# EAGLE design BMWifi (EAGLE 9.6.1)
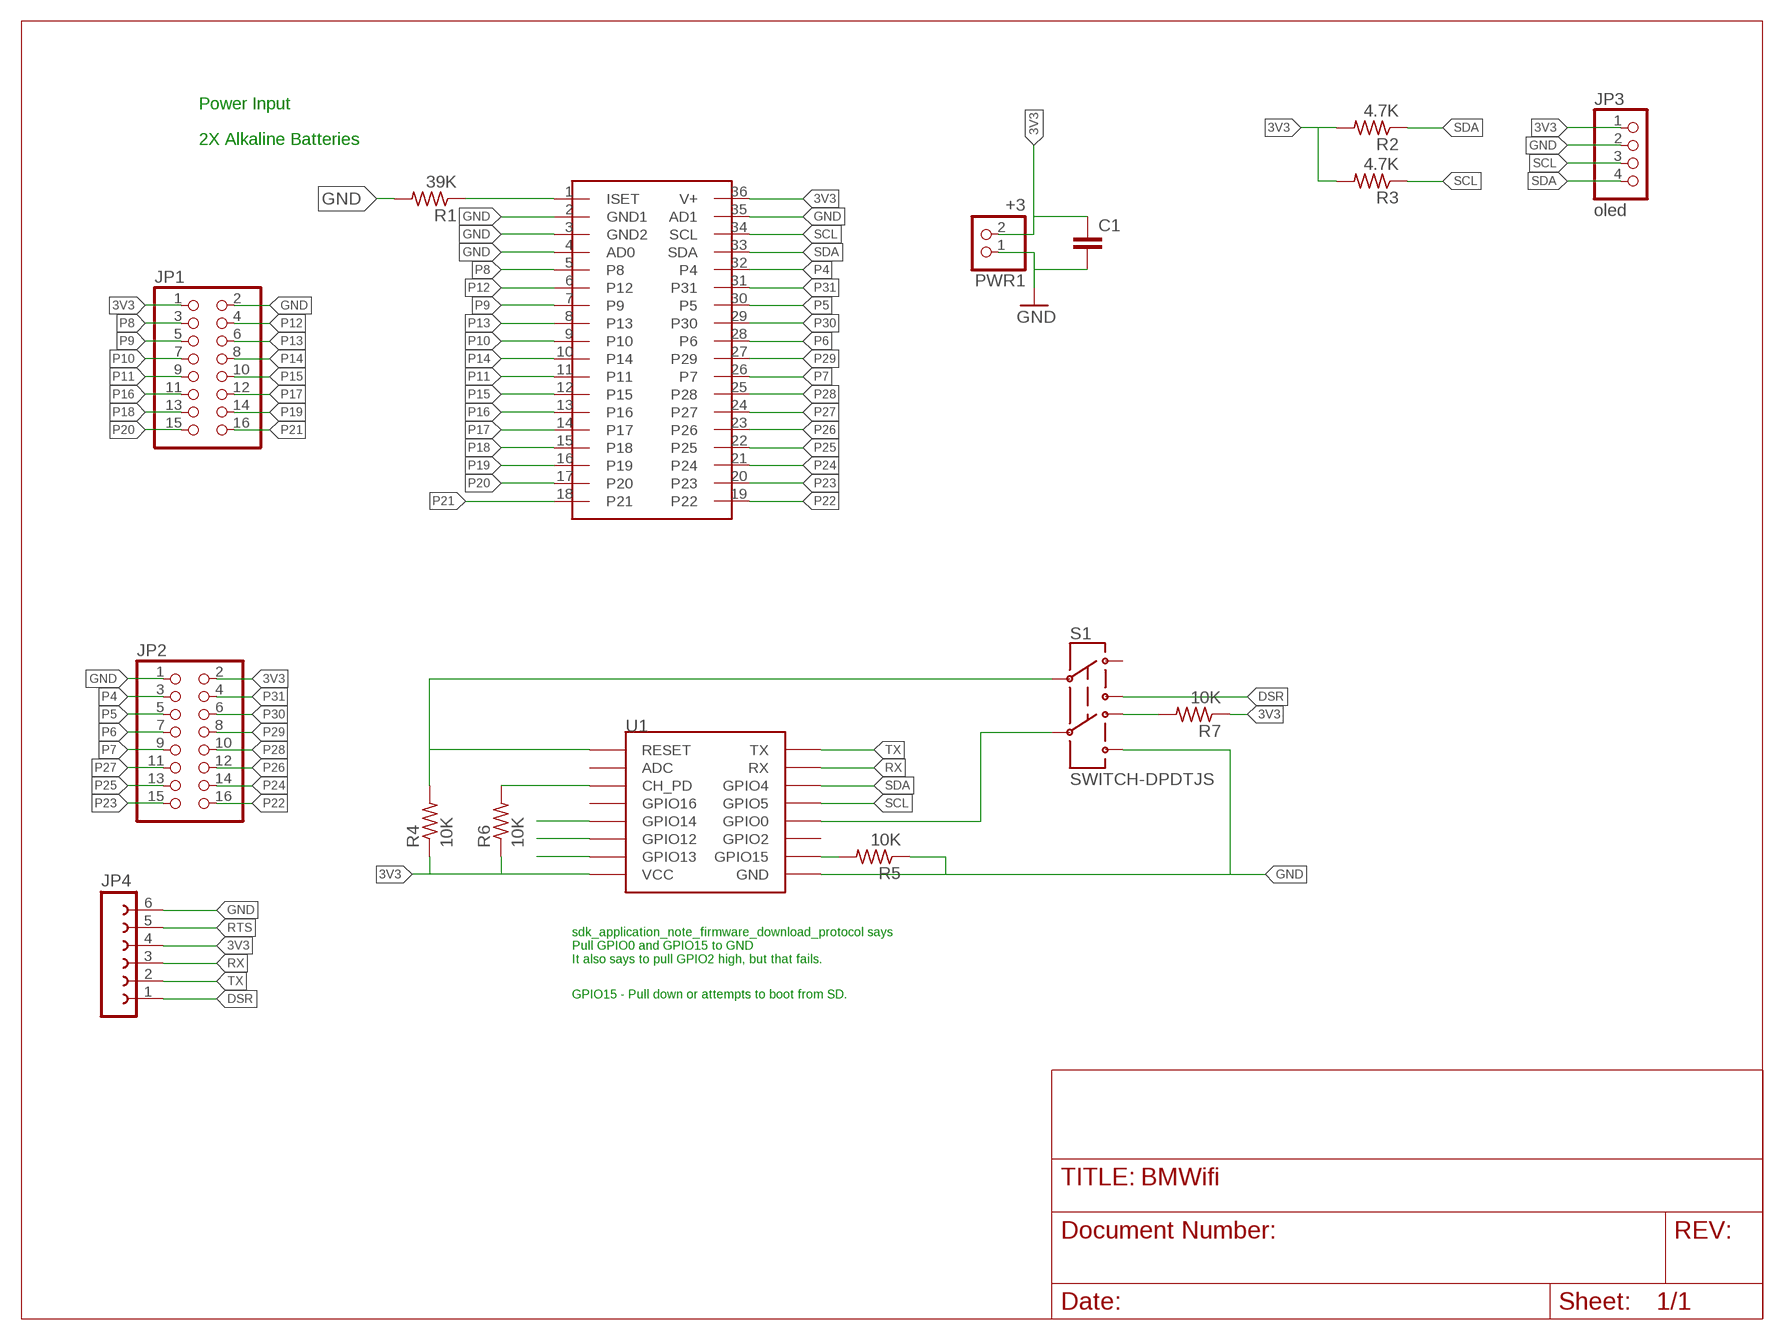
[diagram p0: schematic, sheet 1]

## Parts
C1  C2.5/2  [C2.5-2]
JP1  PINHD-2X8  [2X08]
JP2  PINHD-2X8  [2X08]
JP3  oled  PINHD-1X4  [1X04]
JP4  FE06W  [FE06W]
PWR1  +3  PINHD-1X2  [1X02]
R1  39K  R-US_M1206  [M1206]
R2  4.7K  R-US_M1206  [M1206]
R3  4.7K  R-US_M1206  [M1206]
R4  10K  R-US_M1206  [M1206]
R5  10K  R-US_M1206  [M1206]
R6  10K  R-US_M1206  [M1206]
R7  10K  R-US_M1206  [M1206]
S1  SWITCH-DPDTJS  [JS202011CQN]
U1  ESP12  [ESP12]
U$1  MAX6956  [SSOP36]

## Nets
3V3: C1.1 JP1.1 JP2.2 JP3.1 JP4.4 PWR1.2 R2.2 R3.2 R4.1 R6.1 R7.1 U1.VCC U$1.36(V+)
CH_PD: R6.2 U1.CH_PD
DSR: JP4.1 S1.3
GND: C1.2 JP1.2 JP2.1 JP3.2 JP4.6 PWR1.1 R1.2 R5.1 S1.6 U1.GND U$1.2(GND1) U$1.3(GND2) U$1.4(AD0) U$1.35(AD1)
GPIO0: S1.5 U1.GPIO0
GPIO14: U1.GPIO14
GPIO15: R5.2 U1.GPIO15
ISET: R1.1 U$1.1(ISET)
N$1: U1.GPIO13
N$2: R7.2 S1.4
N$3: U1.GPIO12
P4: JP2.3 U$1.32(P4)
P5: JP2.5 U$1.30(P5)
P6: JP2.7 U$1.28(P6)
P7: JP2.9 U$1.26(P7)
P8: JP1.3 U$1.5(P8)
P9: JP1.5 U$1.7(P9)
P10: JP1.7 U$1.9(P10)
P11: JP1.9 U$1.11
P12: JP1.4 U$1.6(P12)
P13: JP1.6 U$1.8(P13)
P14: JP1.8 U$1.10(P14)
P15: JP1.10 U$1.12(P15)
P16: JP1.11 U$1.13(P16)
P17: JP1.12 U$1.14(P17)
P18: JP1.13 U$1.15(P18)
P19: JP1.14 U$1.16(P19)
P20: JP1.15 U$1.17(P20)
P21: JP1.16 U$1.18(P21)
P22: JP2.16 U$1.19(P22)
P23: JP2.15 U$1.20(P23)
P24: JP2.14 U$1.21(P24)
P25: JP2.13 U$1.22(P25)
P26: JP2.12 U$1.23(P26)
P27: JP2.11 U$1.24(P27)
P28: JP2.10 U$1.25(P28)
P29: JP2.8 U$1.27(P29)
P30: JP2.6 U$1.29(P30)
P31: JP2.4 U$1.31
RESET: R4.2 S1.2 U1.RESET
RTS: JP4.5
RX: JP4.3 U1.RX
SCL: JP3.3 R3.1 U1.GPIO5 U$1.34(SCL)
SDA: JP3.4 R2.1 U1.GPIO4 U$1.33(SDA)
TX: JP4.2 U1.TX
Unconnected: S1.1 U1.ADC U1.GPIO2 U1.GPIO16

## Notes on the sheet
- Power Input
- 2X Alkaline Batteries
- sdk_application_note_firmware_download_protocol says
  Pull GPIO0 and GPIO15 to GND
  It also says to pull GPIO2 high, but that fails.
- GPIO15 - Pull down or attempts to boot from SD.

## Library data of the parts
C1 = capacitor-wima:C: CAPACITOR naming: grid - package width
JP1 JP2 = pinhead:PINHD-2X8: PIN HEADER
JP3 = pinhead:PINHD-1X4: PIN HEADER
JP4 = con-lsta:FE06W: FEMALE HEADER; OC_FARNELL: unknown; OC_NEWARK: unknown
PWR1 = pinhead:PINHD-1X2: PIN HEADER
R1-R7 = resistor:R-US_: RESISTOR, American symbol
S1 = Switches:SWITCH-DPDT: DPDT Version of the COM-00597
U1 = esp8266modules:ESP12: ESP8266 Wifi module 12
U$1 = Kevin:MAX6956

## Board
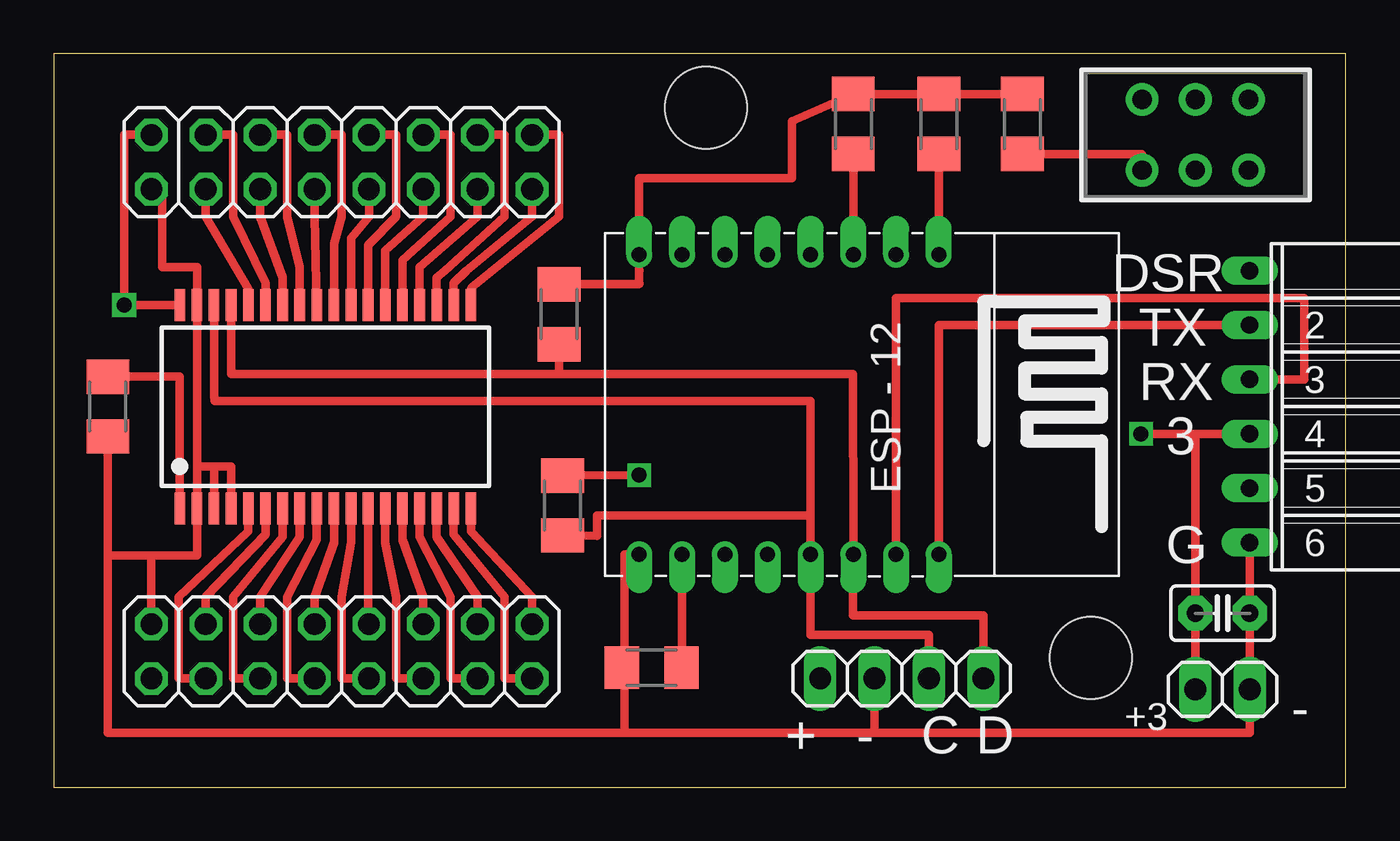
[diagram p1: board, top side]
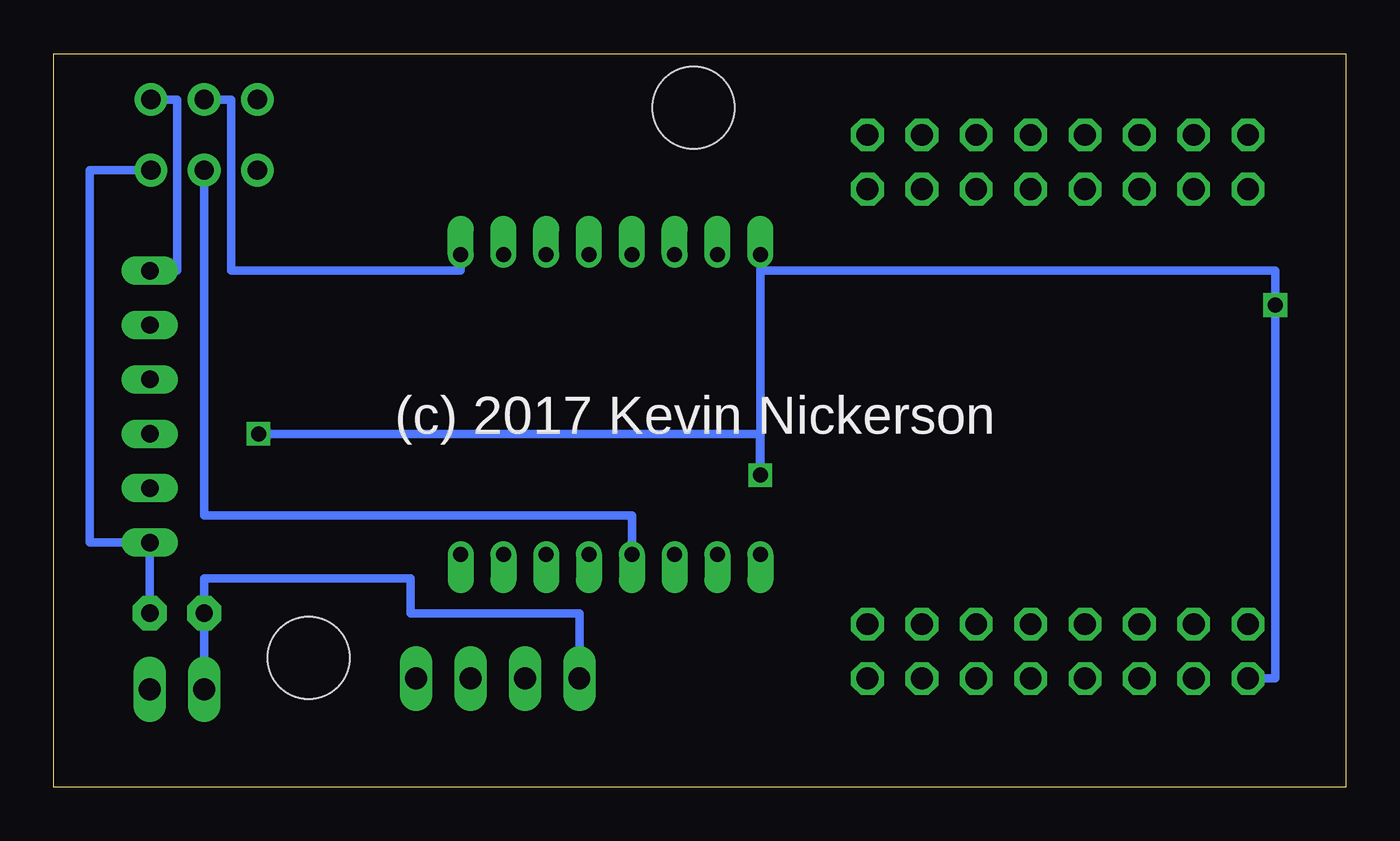
[diagram p2: board, bottom side, seen from below]

Size 60.38 x 34.28 mm. Coordinates in mm from the lower left corner, seen from the top.
Outline: 0,0 60.38,0 60.38,34.28 0,34.28 0,0
Copper layers (1*16): Top 0.035mm / dielectric 1.5mm / Bottom 0.035mm
Design rules "default": minimum track width 10mil, minimum drill 24mil, track to track 8mil, track to pad 8mil, pad to pad 8mil, via to via 8mil, smd to smd 8mil, copper to edge 40mil, drill to drill 8mil, minimum pad ring 10mil, minimum via ring 8mil, stop-mask expansion 4mil, vias tented up to drill 0mil, thermal gap 10mil
Holes 3.81 mm at 30.48,31.75 48.46,6.05

### Footprints (pad centres in the part's own frame; a part is rotated, then mirrored left to right if it is on the bottom)
C2.5-2 = drill 0.813 pad 1.6 octagon: 1 -1.27,0; 2 1.27,0
2X08 = drill 1.016 octagon: 1 -8.89,-1.27; 2 -8.89,1.27; 3 -6.35,-1.27; 4 -6.35,1.27; 5 -3.81,-1.27; 6 -3.81,1.27; 7 -1.27,-1.27; 8 -1.27,1.27; 9 1.27,-1.27; 10 1.27,1.27; 11 3.81,-1.27; 12 3.81,1.27; 13 6.35,-1.27; 14 6.35,1.27; 15 8.89,-1.27; 16 8.89,1.27
1X04 = drill 1.016 long: 1 -3.81,0; 2 -1.27,0; 3 1.27,0; 4 3.81,0
FE06W = drill 0.813 long: 1 -6.35,0; 2 -3.81,0; 3 -1.27,0; 4 1.27,0; 5 3.81,0; 6 6.35,0
1X02 = drill 1.016 long: 1 -1.27,0; 2 1.27,0
M1206 = smd 1.6 x 2: 1 -1.4,0; 2 1.4,0
JS202011CQN = drill 0.9 pad 1.524: 1 -1.651,-2.489; 2 -1.651,0; 3 -1.651,2.489; 4 1.651,-2.489; 5 1.651,0; 6 1.651,2.489
ESP12 = drill 0.7 offset: ADC -7.1,3.8; CH_PD -7.1,1.8; GND 6.9,-8.2; GPIO0 6.9,-2.2; GPIO2 6.9,-4.2; GPIO4 6.9,1.8; GPIO5 6.9,-0.2; GPIO12 -7.1,-4.2; GPIO13 -7.1,-6.2; GPIO14 -7.1,-2.2; GPIO15 6.9,-6.2; GPIO16 -7.1,-0.2; RESET -7.1,5.8; RX 6.9,3.8; TX 6.9,5.8; VCC -7.1,-8.2
SSOP36 = smd 0.5 x 1.5: 1 -6.8,-4.75; 2 -6,-4.75; 3 -5.2,-4.75; 4 -4.4,-4.75; 5 -3.6,-4.75; 6 -2.8,-4.75; 7 -2,-4.75; 8 -1.2,-4.75; 9 -0.4,-4.75; 10 0.4,-4.75; 11 1.2,-4.75; 12 2,-4.75; 13 2.8,-4.75; 14 3.6,-4.75; 15 4.4,-4.75; 16 5.2,-4.75; 17 6,-4.75; 18 6.8,-4.75; 19 6.8,4.75; 20 6,4.75; 21 5.2,4.75; 22 4.4,4.75; 23 3.6,4.75; 24 2.8,4.75; 25 2,4.75; 26 1.2,4.75; 27 0.4,4.75; 28 -0.4,4.75; 29 -1.2,4.75; 30 -2,4.75; 31 -2.8,4.75; 32 -3.6,4.75; 33 -4.4,4.75; 34 -5.2,4.75; 35 -6,4.75; 36 -6.8,4.75

### Placement (x,y rotation side)
C1  54.61,8.13 0 top
JP1  13.46,6.35 0 top
JP2  13.46,29.21 0 top
JP3  39.62,5.08 0 top
JP4  55.88,17.78 270 top
PWR1  54.61,4.57 180 top
R1  2.54,17.78 270 top
R2  23.62,22.1 90 top
R3  23.77,13.16 90 top
R4  41.36,30.99 270 top
R5  27.94,5.59 0 top
R6  37.36,30.99 270 top
R7  45.26,30.99 270 top
S1  53.34,30.48 270 top
U1  35.56,17.78 270 top
U$1  12.7,17.78 0 top

### Tracks (layer width: path | path; a pad name or v marks a point on that pad's centre or on a via)
3V3  (via drill 0.7)
  Top 0.406: R7.1 R4.1 R6.1 34.49,31.12 34.49,28.45 27.36,28.45 U1.VCC | PWR1.2 53.34,16.51 v50.8,16.51 JP4.4 | U$1.36 v3.3,22.53 3.81,22.5 3.3,22.5 3.3,30.48 JP2.2 | 27.37,24.14 27.36,24.14 U1.VCC | R2.2 27.36,23.5 | R3.2 v27.36,14.58 | 27.38,23.52 27.36,23.5 | 27.36,23.5 U1.VCC | 35.81,4.24 JP3.1
  Bottom 0.406: JP3.1 35.81,8.13 43.69,8.13 43.69,9.75 53.34,9.75 C1.1 PWR1.2 | 27.36,24.13 3.3,24.13 v3.3,22.53 3.3,5.08 JP1.1 | 27.36,24.13 v27.36,14.58 27.38,14.58 27.38,16.51 v50.8,16.51 | 27.36,24.13 U1.VCC
CH_PD
  Top 0.406: R6.2 37.36,27.94 U1.CH_PD
DSR
  Bottom 0.406: JP4.1 54.61,24.13 54.61,32.13 S1.3
GND
  Top 0.406: U$1.3 7.5,14.99 | U$1.4 8.3,14.99 7.5,14.99 | 7.5,14.99 6.7,14.99 | 4.57,10.82 6.7,10.82 U$1.2 6.7,14.99 | JP4.6 PWR1.1 55.88,2.54 38.35,2.54 | 6.7,14.99 U$1.35 6.7,24.31 5.08,24.31 5.08,27.94 JP2.1 | R5.1 26.67,5.59 | U1.GND 26.67,10.88 26.67,5.59 | JP1.2 4.57,10.82 | 38.35,2.54 JP3.2 | 26.67,5.59 26.67,2.54 | 38.35,2.54 26.67,2.54 | R1.2 2.54,10.82 | 2.54,10.82 4.57,10.82 | 26.67,2.54 2.54,2.54 2.54,10.82
  Bottom 0.406: S1.6 58.67,28.83 58.67,11.43 JP4.6 C1.2
GPIO0
  Bottom 0.406: S1.5 53.34,12.7 33.36,12.7 U1.GPIO0
GPIO15
  Top 0.406: U1.GPIO15 29.36,5.59 R5.2
ISET
  Top 0.406: R1.1 5.9,19.18 U$1.1
N$2
  Top 0.406: R7.2 50.85,29.59 S1.4
P4
  Top 0.406: U$1.32 9.1,23.29 7.11,26.67 JP2.3
P5
  Top 0.406: U$1.30 10.7,23.8 9.65,26.67 JP2.5
P6
  Top 0.406: U$1.28 12.19,26.67 JP2.7
P7
  Top 0.406: U$1.26 13.9,25.65 14.73,26.67 JP2.9
P8
  Top 0.406: U$1.5 9.1,11.94 5.84,8.89 5.84,5.08 JP1.3
P9
  Top 0.406: U$1.7 10.7,11.68 8.38,8.89 8.38,5.08 JP1.5
P10
  Top 0.406: U$1.9 12.29,11.76 12.29,11.56 10.92,8.89 10.92,5.08 JP1.7
P11
  Top 0.406: U$1.11 13.9,11.43 13.46,8.89 13.46,5.08 JP1.9
P12
  Top 0.406: U$1.6 9.9,11.81 7.11,8.89 JP1.4
P13
  Top 0.406: U$1.8 11.5,11.68 9.65,8.89 JP1.6
P14
  Top 0.406: U$1.10 13.1,11.43 12.19,8.89 JP1.8
P15
  Top 0.406: 14.73,13.03 U$1.12 14.7,7.62 JP1.10
P16
  Top 0.406: U$1.13 15.5,11.43 16,8.89 16,5.08 JP1.11
P17
  Top 0.406: U$1.14 16.3,11.56 17.27,8.89 JP1.12
P18
  Top 0.406: U$1.15 17.1,11.68 18.54,8.89 18.54,5.08 JP1.13
P19
  Top 0.406: U$1.16 17.9,11.68 19.81,8.89 JP1.14
P20
  Top 0.406: U$1.17 18.7,11.81 21.08,8.89 21.08,5.08 JP1.15
P21
  Top 0.406: U$1.18 19.5,11.94 22.35,8.89 JP1.16
P22
  Top 0.406: U$1.19 19.5,23.29 19.56,23.37 23.62,26.67 23.62,30.48 JP2.16
P23
  Top 0.406: U$1.20 18.7,23.55 19.3,24.13 22.35,26.67 JP2.15
P24
  Top 0.406: U$1.21 17.9,23.8 18.29,24.13 21.08,26.67 21.08,30.48 JP2.14
P25
  Top 0.406: U$1.22 17.1,24.31 19.81,26.67 JP2.13
P26
  Top 0.406: U$1.23 16.3,24.64 18.54,26.67 18.54,30.48 JP2.12
P27
  Top 0.406: U$1.24 15.5,25.07 17.27,26.67 JP2.11
P28
  Top 0.406: U$1.25 14.7,25.32 16,26.67 16,30.48 JP2.10
P29
  Top 0.406: U$1.27 13.1,25.4 13.46,26.67 13.46,30.48 JP2.8
P30
  Top 0.406: U$1.29 11.5,24.31 10.92,26.67 10.92,30.48 JP2.6
P31
  Top 0.406: U$1.31 9.9,23.55 8.38,26.67 8.38,30.48 JP2.4
RESET
  Top 0.406: R4.2 U1.RESET
  Bottom 0.406: S1.2 52.07,32.13 52.07,24.13 41.36,24.13 U1.RESET
RX
  Top 0.406: JP4.3 58.42,19.05 58.42,22.86 39.36,22.86 U1.RX
SCL
  Top 0.406: U$1.34 7.5,18.29 7.52,18.03 35.36,18.03 35.36,12.7 | JP3.3 40.89,7.11 35.36,7.11 U1.GPIO5 35.36,12.7 | R3.1 25.4,11.73 25.4,12.7 35.36,12.7
  Bottom 0.406: U1.GPIO5 35.31,9.61
SDA
  Top 0.406: U$1.33 8.3,19.3 23.62,19.3 | 23.62,19.3 37.34,19.3 37.34,17.78 37.36,13.02 U1.GPIO4 37.34,9.61 37.34,8.03 43.43,8.03 JP3.4 | R2.1 23.62,19.3
TX
  Top 0.406: JP4.2 41.36,21.59 U1.TX

### Text on the board
bPlace: (c) 2017 Kevin Nickerson
tNames: DSR | TX | RX | 3 | G | - | + | - | C | D